# EAGLE design controller (EAGLE 7.4.0)
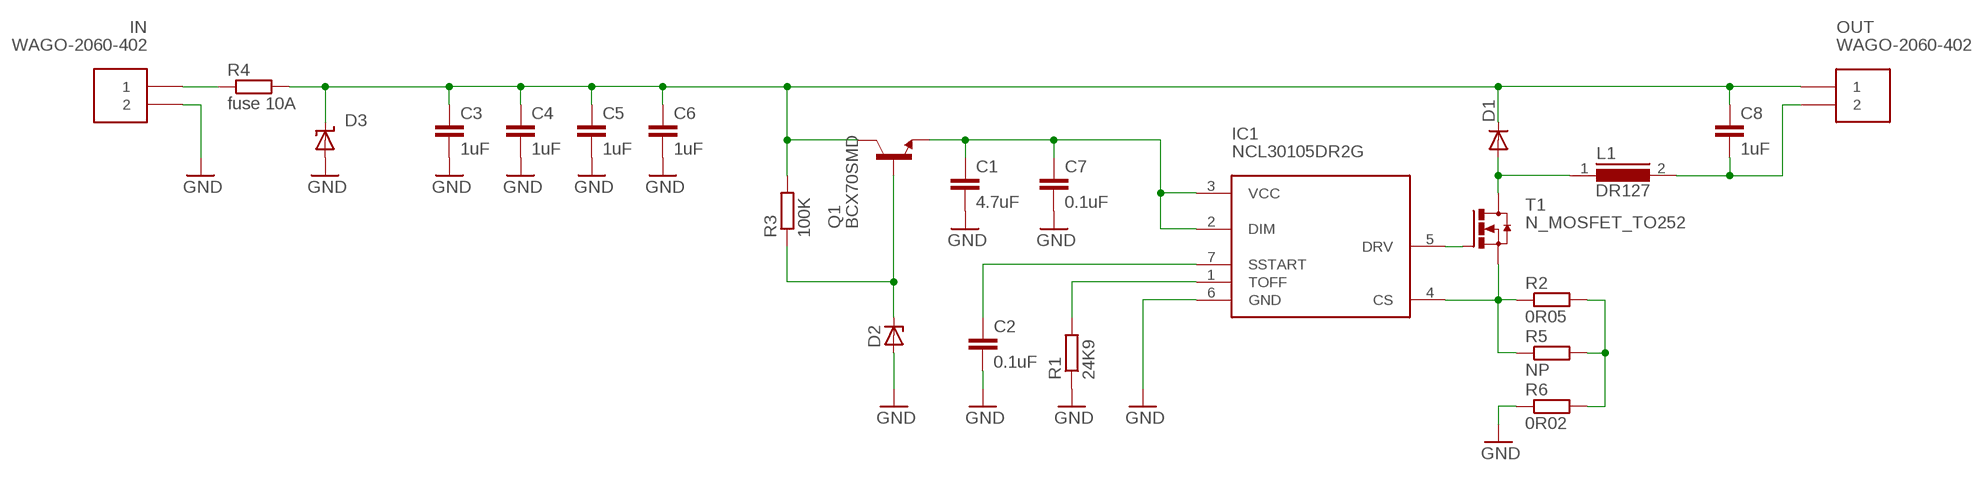
[diagram p0: schematic, sheet 1]

## Parts
C1  4.7uF  C-EUC0805  [C0805]
C2  0.1uF  C-EUC0603  [C0603]
C3  1uF  C-EUC1210  [C1210]
C4  1uF  C-EUC1210  [C1210]
C5  1uF  C-EUC1210  [C1210]
C6  1uF  C-EUC1210  [C1210]
C7  0.1uF  C-EUC0805  [C0805]
C8  1uF  C-EUC1210  [C1210]
D1  DIODE-SMC  [SMC]
D2  ZENER-DIODESOT23  [SOT23]
D3  SUPPRESSOR-SMBJ  [SMBJ]
IC1  NCL30105DR2G  [SOIC8]
IN  WAGO-2060-402  [WAGO-2060-402]
L1  DR127  [DR127]
OUT  WAGO-2060-402  [WAGO-2060-402]
Q1  BCX70SMD  [SOT23]
R1  24K9  R-EU_R0603  [R0603]
R2  0R05  R-EU_R1210  [R1210]
R3  100K  R-EU_R1206  [R1206]
R4  fuse 10A  R-EU_R1206  [R1206]
R5  NP  R-EU_R1210  [R1210]
R6  0R02  R-EU_R1210  [R1210]
T1  N_MOSFET_TO252  [TO252]

## Nets
GND: C1.2 C2.2 C3.2 C4.2 C5.2 C6.2 C7.2 D2.1(A) D3.A IC1.6(GND) IN.2_1 IN.2_2 R1.1 R6.1
N$1: IC1.5(DRV) T1.1(G)
N$2: C2.1 IC1.7(SSTART)
N$3: IC1.4(CS) R2.1 R5.1 T1.3(S)
N$4: R2.2 R5.2 R6.2
N$5: D1.A L1.1 T1.4(D)
N$6: IC1.1(TOFF) R1.2
N$7: C8.2 L1.2 OUT.2_1 OUT.2_2
N$8: C1.1 C7.1 IC1.2(DIM) IC1.3(VCC) Q1.2(E)
N$9: D2.3(C) Q1.1(B) R3.1
N$10: IN.1_1 IN.1_2 R4.1
VIN: C3.1 C4.1 C5.1 C6.1 C8.1 D1.C D3.C OUT.1_1 OUT.1_2 Q1.3(C) R3.2 R4.2

## Library data of the parts
C1-C8 = rcl:C-EU: CAPACITOR, European symbol
D1 = diode:DIODE-: DIODE
D2 = diode:ZENER-DIODE: Z-Diode
D3 = diode:SUPPRESSOR-: Suppressor diode
IC1 = onsemi-led-driver:NCL30105
IN OUT = wago-2060:WAGO-2060-402
L1 = inductors:DR127: High Power Density, High Efficiency, Shielded Inductors Source: coiltronics_dr_series.pdf
Q1 = transistor-npn:BCX70*: NPN Transistor
R1-R6 = rcl:R-EU_: RESISTOR, European symbol
T1 = power-mosfet:N_MOSFET_TO252

## Board
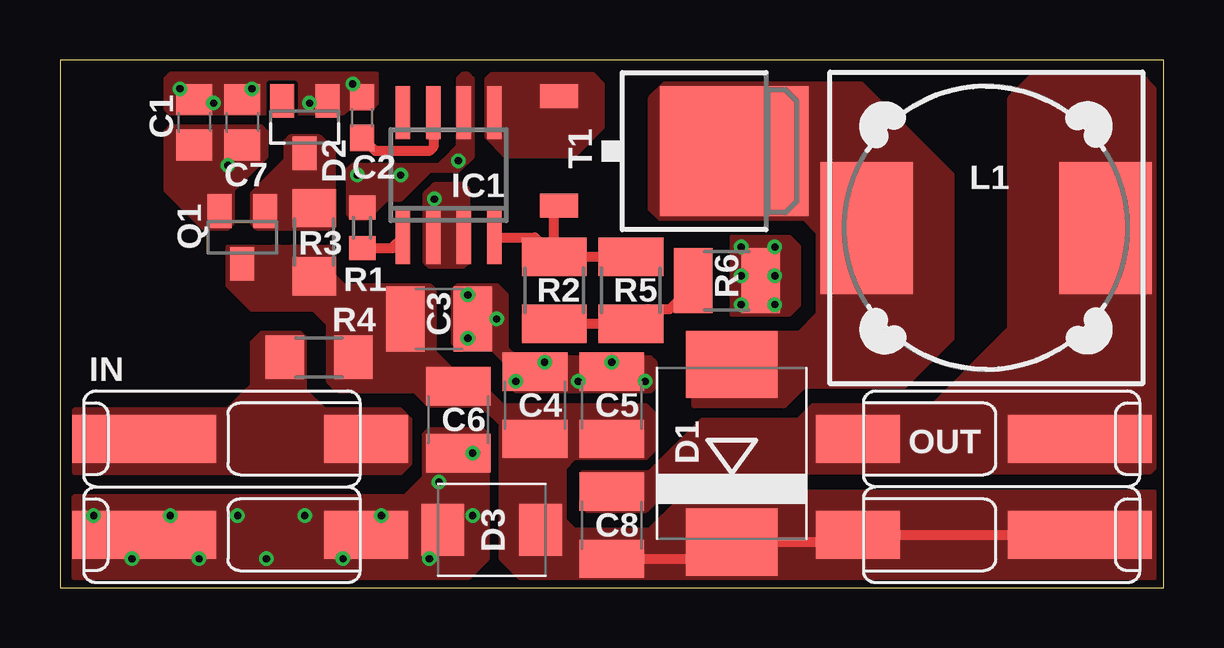
[diagram p1: board, top side]
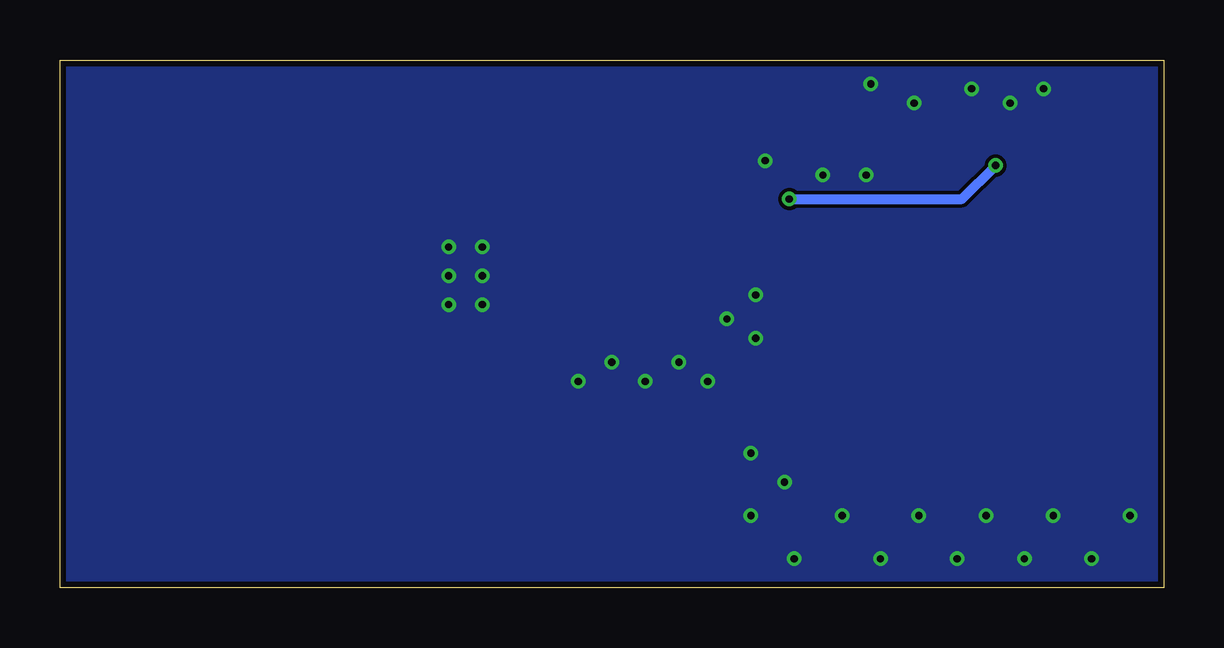
[diagram p2: board, bottom side, seen from below]

Size 46 x 22 mm. Coordinates in mm from the lower left corner, seen from the top.
Outline: 0,0 46,0 46,22 0,22 0,0
Copper layers (1*16): Top 0.035mm / dielectric 1.5mm / Bottom 0.035mm
Design rules "SeeedStudio_2layer_DRU_no_angle_20140221 *": minimum track width 6mil, minimum drill 0.3mm, track to track 6mil, track to pad 6mil, pad to pad 6mil, via to via 6mil, smd to smd 0mil, copper to edge 10mil, drill to drill 10mil, minimum pad ring 10mil, minimum via ring 6mil, stop-mask expansion 2mil, vias tented up to drill 100mil, thermal gap 10mil

### Footprints (pad centres in the part's own frame; a part is rotated, then mirrored left to right if it is on the bottom)
C0805 = smd 1.3 x 1.5: 1 -0.95,0; 2 0.95,0
C0603 = smd 1.1 x 1: 1 -0.85,0; 2 0.85,0
C1210 = smd 1.6 x 2.7: 1 -1.4,0; 2 1.4,0
SMC = smd 2.8 x 3.8: A 3.7,0; C -3.7,0
SOT23 = smd 1 x 1.4: 1 -0.95,-1.1; 2 0.95,-1.1; 3 0,1.1
SMBJ = smd 1.78 x 2.16: A 2.04,0; C -2.03,0
SOIC8 = smd 0.6 x 2.2: 1 -1.905,-2.6; 2 -0.635,-2.6; 3 0.635,-2.6; 4 1.905,-2.6; 5 1.905,2.6; 6 0.635,2.6; 7 -0.635,2.6; 8 -1.905,2.6
WAGO-2060-402 = smd 6 x 2: 1_1 2.5,2; 2_1 2.5,-2 | smd 3.5 x 2: 1_2 11.75,2; 2_2 11.75,-2
DR127 = smd 3.85 x 5.5: 1 -4.975,0; 2 4.975,0
R0603 = smd 1 x 1.1: 1 -0.85,0; 2 0.85,0
R1210 = smd 1.6 x 2.7: 1 -1.4,0; 2 1.4,0
R1206 = smd 1.6 x 1.803: 1 -1.422,0; 2 1.422,0
TO252 = smd 1 x 1.6: 1 -2.28,-4.8; 3 2.28,-4.8 | smd 5.4 x 6.2: 4 0,2.5

### Placement (x,y rotation side)
C1  5.6,19.4 90 top
C2  12.6,19.6 90 top
C3  15.8,11.2 0 top
C4  19.8,7.6 90 top
C5  23,7.6 90 top
C6  16.6,7 270 top
C7  7.6,19.4 90 top
C8  23,2.6 90 top
D1  28,5.6 90 top
D2  10.2,19.2 180 top
D3  18,2.4 180 top
IC1  16.2,17.2 0 top
IN  1,4.2 0 top
L1  38.6,15 0 top
OUT  45,4.2 180 top
Q1  7.6,14.6 180 top
R1  12.6,15 270 top
R2  20.6,12.4 270 top
R3  10.6,14.4 270 top
R4  10.8,9.6 0 top
R5  23.8,12.4 270 top
R6  27.8,12.8 180 top
T1  25.6,18.2 270 top

### Tracks (layer width: path | path; a pad name or v marks a point on that pad's centre or on a via)
GND  (via drill 0.3)
  other vias: 1.4,3 28.4,14.2 29.8,14.2 28.4,13 28.4,11.8 29.8,13 29.8,11.8 17,12.2 18.2,11.2 17,10.4 19,8.6 20.2,9.4 21.6,8.6 23,9.4 24.4,8.6 3,1.2 4.6,3 5.8,1.2 7.4,3 8.6,1.2 10.2,3 11.8,1.2 13.4,3 15.4,1.2 17.2,3 17.2,5.6 15.8,4.4 5,20.8 6.4,20.2 8,20.8 10.4,20.2 12.2,21 12.4,17.2 14.2,17.2 16.6,17.8
  pour Bottom: 0,0 46,0 46,22 0,22
  pour Top (no thermals): 28,11.4 30.4,11.4 30.8,11.8 30.8,14.2 30.4,14.6 28,14.6
  pour Top (no thermals): 16.4,12.4 16.6,12.6 18.2,12.6 18.6,12.2 18.6,10 19,9.6 24.6,9.6 24.8,9.4 24.8,8.4 24.6,8.2 19,8.2 18.6,8.6 18.6,9.4 18,10 16.6,10 16.4,10.2
  pour Top (no thermals): 0.6,3.8 14.4,3.8 15.2,4.6 15.2,6.4 15.4,6.6 17.6,6.6 17.8,6.4 17.8,1.2 17,0.4 0.6,0.4
  pour Top (no thermals): 5,19.8 11.8,19.8 12,20 13,20 13.2,20.2 13.2,21.4 4.6,21.4 4.4,21.2 4.4,20 4.6,19.8
  pour Top (no thermals): 12.2,15.4 12.8,15.4 13.6,16.2 14.2,16.2 15.2,17.2 15.4,17.4 16.6,17.4 17.2,18 17.2,21.2 17,21.4 16.8,21.4 16.6,21.2 16.6,18.4 16,17.8 15.8,17.6 12.2,17.6 12,17.4 12,15.6
N$1
  pour Top (no thermals): 17.8,21 17.8,21.2 18,21.4 22.2,21.4 22.6,21 22.6,19.2 21.4,18 18.6,18 17.8,18.8
N$2
  Top 0.406: IC1.7 15.57,18.36 15.4,18.2 13.15,18.2 C2.1
N$3
  Top 0.406: IC1.4 19.8,14.6 R2.1 | R2.1 20.6,15.72 T1.3 | R2.1 22.8,13.8 23,14 23.6,14 R5.1
N$4
  Top 0.406: R6.2 26.4,12.6 25.4,11.6 24.4,11.6 R5.2 21.6,11 21.4,11.2 20.8,11.2 R2.2
N$5
  pour Top (no thermals): 26.4,7.6 30.2,7.6 31,8.4 35.2,8.4 37.2,10.4 37.2,17.2 33.4,21 25.2,21 24.6,20.4 24.6,15.8 25,15.4 31,15.4 31.6,14.8 31.6,11.4 30.8,10.6 26.4,10.6
N$6
  Top 0.406: R1.2 13.84,14.15 IC1.1
N$7
  pour Top (no thermals): 21.8,4.8 24.6,4.8 26.8,7 30.8,7 31.4,7.6 36.4,7.6 39.6,10.8 39.6,20.4 40.6,21.4 45,21.4 45.6,20.8 45.6,5 45.4,4.8 28.6,4.8 28.2,4.4 25.6,4.4 24.4,3.2 22,3.2 21.8,3.4
N$8  (via drill 0.3)
  Bottom 0.406: v15.6,16.2 8.4,16.2 v7,17.6
  pour Top (no thermals): 6,15 7,15 7.2,15.2 7.2,16.6 8.4,17.8 8.6,18 8.6,19 8.4,19.2 4.6,19.2 4.4,19 4.4,16.6
  pour Top (no thermals): 15.4,13.4 16.8,13.4 17,13.6 17,16.6 16.8,16.8 15.6,16.8 15.4,16.6 15.2,16.4 15.2,13.6
N$9
  pour Top (no thermals): 8.2,15 11.2,15 11.4,15.2 11.4,18.2 10.8,18.8 9.6,18.8 9.4,18.6 9.4,17.8 8,16.4 8,15.2
N$10
  pour Top (no thermals): 0.6,4.8 14.2,4.8 14.6,5.2 14.6,7 14.2,7.4 11,7.4 10.2,8.2 10.2,10.4 10,10.6 8.4,10.6 8,10.2 8,8.4 7,7.4 0.6,7.4
VIN
  Top 0.406: C8.1 27.3,1.2 D1.C 32.95,1.9 OUT.1_2 OUT.1_1
  pour Top (no thermals): 11.2,8.6 11.2,11 10.6,11.6 8,11.6 7,12.6 7,14.2 11.2,14.2 11.4,14 11.4,13 11.8,12.6 15.4,12.6 15.6,12.4 15.6,9.8 16.4,9 17,9 18.4,7.6 24.4,7.6 24.8,7.2 24.8,5.8 24.4,5.4 21.4,5.4 21,5 21,2.8 21.4,2.4 24.6,2.4 25.8,3.6 28.6,3.6 29,4 45.6,4 45.6,0.4 19.2,0.4 18.4,1.2 18.4,6.8 17.6,7.6 15.4,7.6 14.8,8.2 11.6,8.2